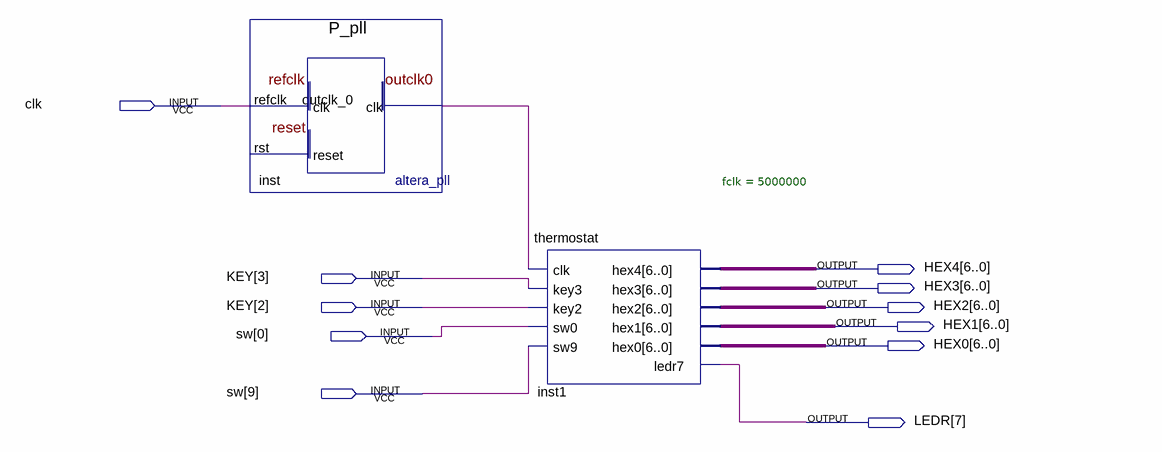
[diagram p0: schematic sheet]
// Quartus schematic Fpga_project.bdf as structural Verilog: 2 symbols, 11 pins
module Fpga_project (
  input  clk,
  input  [3:2] KEY,
  input  [9:0] sw,
  output [6:0] HEX4,
  output [6:0] HEX3,
  output [6:0] HEX2,
  output [6:0] HEX1,
  output [6:0] HEX0,
  output [7:7] LEDR
);

  wire inst_outclk_0;

  P_pll inst (.refclk(clk), .outclk_0(inst_outclk_0));  // open: rst
  thermostat #(.fclk(5000000)) inst1 (
    .clk(inst_outclk_0), .key3(KEY[3]), .key2(KEY[2]), .sw0(sw[0]), .sw9(sw[9]), .hex4(HEX4), .hex3(HEX3),
    .hex2(HEX2), .hex1(HEX1), .hex0(HEX0), .ledr7(LEDR[7]));
endmodule
